# Altium schematic sheet BLDC-DRIVER.SchDoc
size 420 x 297 mm; DocumentNumber: АБВГ.000000.000 Э3; SheetNumber: 2; PageSetup: Record=PageOptions|CenterHorizontal=False|CenterVertical=False|PrintScale=0.95|XCorrection=0.00|YCorrection=0.00|PrintKind=1|BorderSize=5000000|LeftOffset=0|BottomOffset=0|Orientation=1|PaperLength=1000|PaperWidth=1000|Scale=100|PaperSource=15|PrintQuality=600|MediaType=1|DitherType=10|PaperKind=A4|PrintScaleMode=1; Letter1Column: {}; Letter2Column: {}; Letter3Column: {}; ProcessInspection: ProcessInspection; EngineerName: EngineerName; NormInspection: NormInspection; DocumentType: DocumentType; Mass: Mass; Scale: Scale; Developer1size1str: Developer1size1str; Developer2size1str: Developer2size1str; Developer2size2str: Developer2size2str; Title1size1str: Title1size1str; Title2size1str: Title2size1str; Title2size2str: Title2size2str; Title3size3str: Title3size3str; Title3size2str: Title3size2str; Title3size1str: Title3size1str; FunctionalGroup: #_
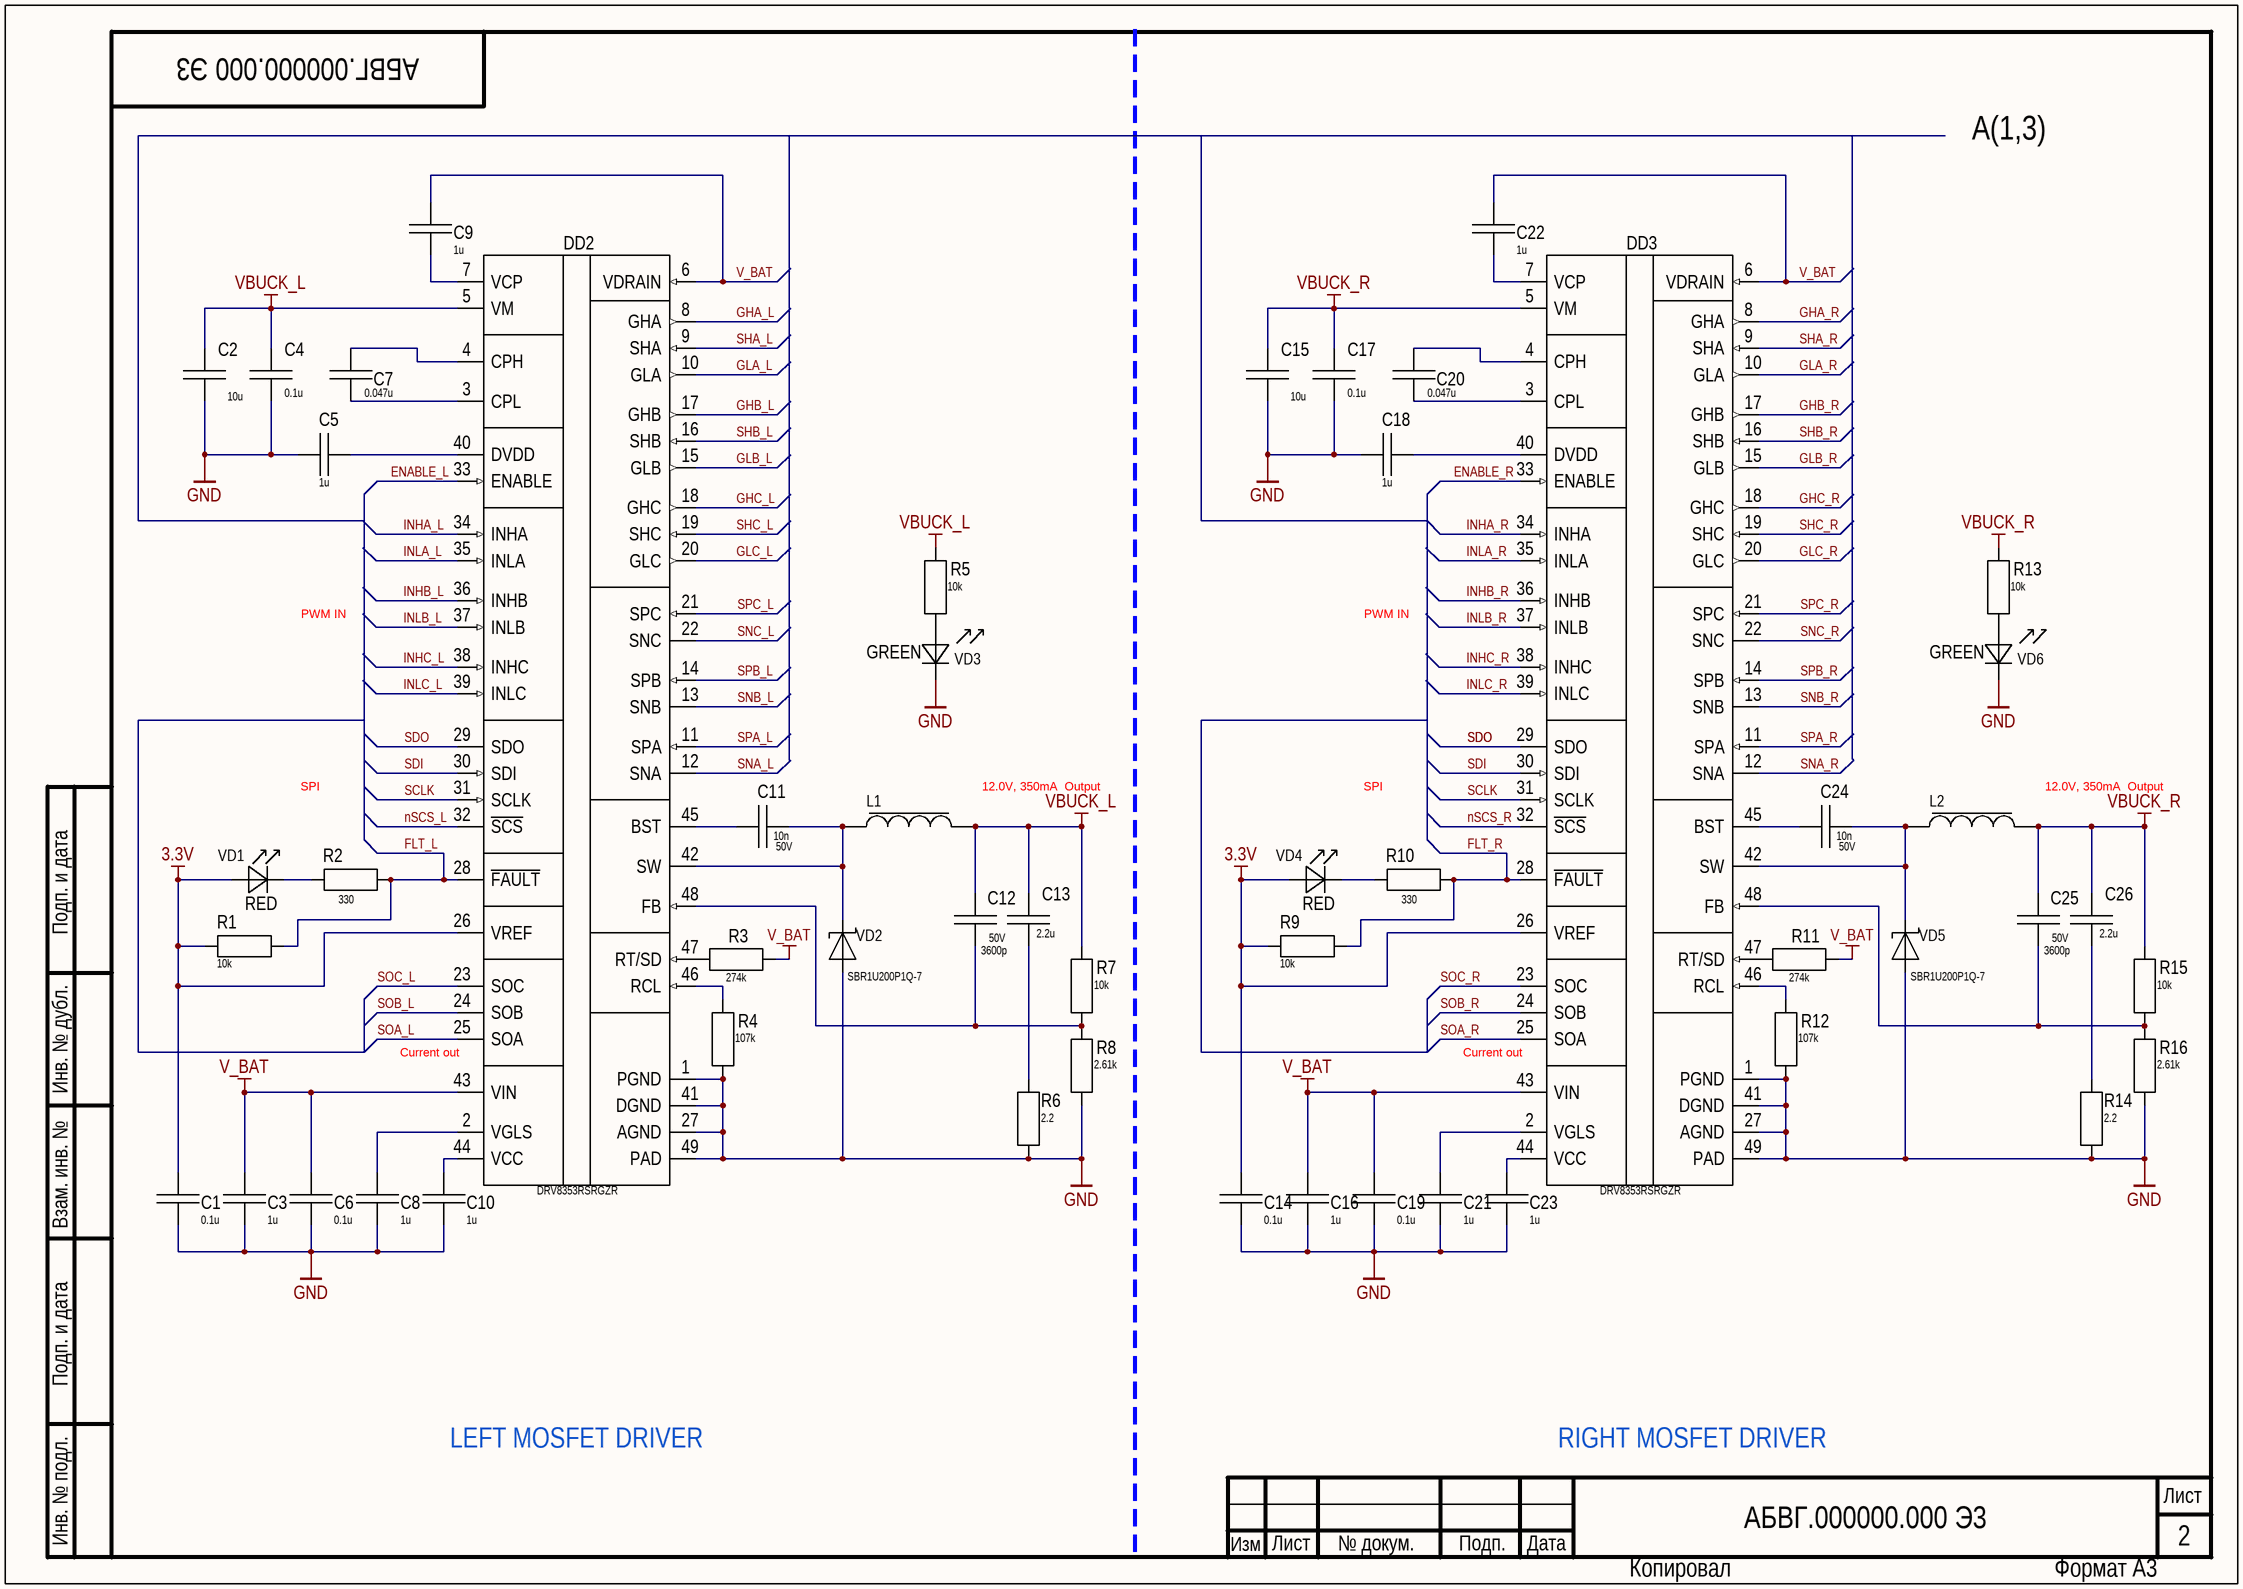
[diagram p0: BLDC-DRIVER.SchDoc]

## Parts
C1  0.1u  [CAP: 0402]
C2  10u  [CAP: 2220]
C3  1u  [CAP: 1206]
C4  0.1u  [CAP: 0805]
C5  1u  [CAP: 0603]
C6  0.1u  [CAP: 0805]
C7  0.047u  [CAP: 0805]
C8  1u  [CAP: 0603]
C9  1u  [CAP: 1206]
C10  1u  [CAP: 0603]
C11  Voltage: 50V  [CAP: 0402]  (hidden comment: 10n)
C12  Voltage: 50V  [CAP: 0402]  (hidden comment: 3600p)
C13  2.2u  [CAP: 0603]
C14  0.1u  [CAP: 0402]
C15  10u  [CAP: 2220]
C16  1u  [CAP: 1206]
C17  0.1u  [CAP: 0805]
C18  1u  [CAP: 0603]
C19  0.1u  [CAP: 0805]
C20  0.047u  [CAP: 0805]
C21  1u  [CAP: 0603]
C22  1u  [CAP: 1206]
C23  1u  [CAP: 0603]
C24  Voltage: 50V  [CAP: 0402]  (hidden comment: 10n)
C25  Voltage: 50V  [CAP: 0402]  (hidden comment: 3600p)
C26  2.2u  [CAP: 0603]
DD2  DRV8353RSRGZR  [48-VQFN]
DD3  DRV8353RSRGZR  [48-VQFN]
L1  (no value)  [IND: 2525]
L2  (no value)  [IND: 2525]
R1  10k  [RES: 0402]
R2  330  [RES: 0402]
R3  274k  [RES: 0402]
R4  107k  [RES: 0402]
R5  10k  [RES: 0402]
R6  2.2  [RES: 0603]
R7  10k  [RES: 0402]
R8  2.61k  [RES: 0402]
R9  10k  [RES: 0402]
R10  330  [RES: 0402]
R11  274k  [RES: 0402]
R12  107k  [RES: 0402]
R13  10k  [RES: 0402]
R14  2.2  [RES: 0603]
R15  10k  [RES: 0402]
R16  2.61k  [RES: 0402]
VD1  value RED  [LED: 0402R]  (hidden comment: Led 0402 RED)
VD2  PartNumber: SBR1U200P1Q-7  [DIODE: PowerDI 123]
VD3  value GREEN  [LED: 0402G]  (hidden comment: Led 0402 GREEN)
VD4  value RED  [LED: 0402R]  (hidden comment: Led 0402 RED)
VD5  PartNumber: SBR1U200P1Q-7  [DIODE: PowerDI 123]
VD6  value GREEN  [LED: 0402G]  (hidden comment: Led 0402 GREEN)

## Nets
3.3V: C1.1 C14.1 DD2.26(VREF) DD3.26(VREF) R1.2 R9.2 VD1.1 VD4.1
GND: C1.2 C2.1 C3.1 C4.1 C5.2 C6.1 C8.1 C10.1 C14.2 C15.1 C16.1 C17.1 C18.2 C19.1 C21.1 C23.1 DD2.1(PGND) DD2.27(AGND) DD2.41(DGND) DD2.49(PAD) DD3.1(PGND) DD3.27(AGND) DD3.41(DGND) DD3.49(PAD) R4.1 R6.1 R8.1 R12.1 R14.1 R16.1 VD2.1 VD3.2 VD5.1 VD6.2
V_BAT: C3.2 C6.2 C9.2 C16.2 C19.2 C22.2 DD2.6(VDRAIN) DD2.43(VIN) DD3.6(VDRAIN) DD3.43(VIN) R3.1 R11.1
VBUCK_L: C2.2 C4.2 C12.2 C13.2 DD2.5(VM) L1.1 R5.2 R7.2
VBUCK_R: C15.2 C17.2 C25.2 C26.2 DD3.5(VM) L2.1 R13.2 R15.2
ENABLE_L: DD2.33(ENABLE)
ENABLE_R: DD3.33(ENABLE)
FLT_L: DD2.28(~{FAULT}) R1.1 R2.1
FLT_R: DD3.28(~{FAULT}) R9.1 R10.1
GHA_L: DD2.8(GHA)
GHA_R: DD3.8(GHA)
GHB_L: DD2.17(GHB)
GHB_R: DD3.17(GHB)
GHC_L: DD2.18(GHC)
GHC_R: DD3.18(GHC)
GLA_L: DD2.10(GLA)
GLA_R: DD3.10(GLA)
GLB_L: DD2.15(GLB)
GLB_R: DD3.15(GLB)
GLC_L: DD2.20(GLC)
GLC_R: DD3.20(GLC)
INHA_L: DD2.34(INHA)
INHA_R: DD3.34(INHA)
INHB_L: DD2.36(INHB)
INHB_R: DD3.36(INHB)
INHC_L: DD2.38(INHC)
INHC_R: DD3.38(INHC)
INLA_L: DD2.35(INLA)
INLA_R: DD3.35(INLA)
INLB_L: DD2.37(INLB)
INLB_R: DD3.37(INLB)
INLC_L: DD2.39(INLC)
INLC_R: DD3.39(INLC)
nSCS_L: DD2.32(~{SCS})
nSCS_R: DD3.32(~{SCS})
SCLK: DD2.31(SCLK) DD3.31(SCLK)
SDI: DD2.30(SDI) DD3.30(SDI)
SDO: DD2.29(SDO) DD3.29(SDO)
SHA_L: DD2.9(SHA)
SHA_R: DD3.9(SHA)
SHB_L: DD2.16(SHB)
SHB_R: DD3.16(SHB)
SHC_L: DD2.19(SHC)
SHC_R: DD3.19(SHC)
SNA_L: DD2.12(SNA)
SNA_R: DD3.12(SNA)
SNB_L: DD2.13(SNB)
SNB_R: DD3.13(SNB)
SNC_L: DD2.22(SNC)
SNC_R: DD3.22(SNC)
SOA_L: DD2.25(SOA)
SOA_R: DD3.25(SOA)
SOB_L: DD2.24(SOB)
SOB_R: DD3.24(SOB)
SOC_L: DD2.23(SOC)
SOC_R: DD3.23(SOC)
SPA_L: DD2.11(SPA)
SPA_R: DD3.11(SPA)
SPB_L: DD2.14(SPB)
SPB_R: DD3.14(SPB)
SPC_L: DD2.21(SPC)
SPC_R: DD3.21(SPC)
NetC5_1: C5.1 DD2.40(DVDD)
NetC7_1: C7.1 DD2.3(CPL)
NetC7_2: C7.2 DD2.4(CPH)
NetC8_2: C8.2 DD2.2(VGLS)
NetC9_1: C9.1 DD2.7(VCP)
NetC10_2: C10.2 DD2.44(VCC)
NetC11_1: C11.1 DD2.45(BST)
NetC11_2: C11.2 DD2.42(SW) L1.2 VD2.2
NetC12_1: C12.1 DD2.48(FB) R7.1 R8.2
NetC13_1: C13.1 R6.2
NetC18_1: C18.1 DD3.40(DVDD)
NetC20_1: C20.1 DD3.3(CPL)
NetC20_2: C20.2 DD3.4(CPH)
NetC21_2: C21.2 DD3.2(VGLS)
NetC22_1: C22.1 DD3.7(VCP)
NetC23_2: C23.2 DD3.44(VCC)
NetC24_1: C24.1 DD3.45(BST)
NetC24_2: C24.2 DD3.42(SW) L2.2 VD5.2
NetC25_1: C25.1 DD3.48(FB) R15.1 R16.2
NetC26_1: C26.1 R14.2
NetDD2_46: DD2.46(RCL) R4.2
NetDD2_47: DD2.47(RT/SD) R3.2
NetDD3_46: DD3.46(RCL) R12.2
NetDD3_47: DD3.47(RT/SD) R11.2
NetR2_2: R2.2 VD1.2
NetR5_1: R5.1 VD3.1
NetR10_2: R10.2 VD4.2
NetR13_1: R13.1 VD6.1

## Notes on the sheet
- А(1,3)
- PWM IN
- SPI
- (near L1) 12.0V, 350mA  Output
- (near L2) 12.0V, 350mA  Output
- (near DD2) Current out
- (near DD3) Current out
- LEFT MOSFET DRIVER
- RIGHT MOSFET DRIVER
- Подп. и дата
- Инв. № дубл.
- Взам. инв. №
- Инв. № подл.
- Лист
- Изм
- № докум.
- Подп.
- Дата
- Копировал
- Формат А3

## Library data of the parts
C1 C14 = CAP 0402: PartNumber: C0402C104K8PAC; Manufacturer: Kemet; Voltage: 10V; Type: Capacitor; Temperature_Range: -55/+85; Tolerance: 10%; Value: 0.1u; Case: 0402
C2 C15 = CAP 2220: PartNumber: CGA9N3X7S2A106K230KE; Voltage: 100V; Tolerance: 10%; Case: 1812; Value: 10u
C3 C9 C16 C22 = CAP 1206: Voltage: 100V; Tolerance: 10%; PartNumber: *; Case: 1206; Value: 1u
C4 C6 C7 C17 C19 C20 = CAP 0805: Voltage: 100V; Tolerance: 10%; PartNumber: *; Case: 0805
  C4 C6 C17 C19: Value: 0.1u
  C7 C20: Value: 0.047u
C5 C8 C10 C18 C21 C23 = CAP 0603: Voltage: 16V; Tolerance: 10%; PartNumber: *; Case: 0603; ComponentLink1Description: Mouser; ComponentLink1URL: *; Value: 1u
C11 C24 = CAP 0402: Tolerance: 10%; PartNumber: *; Case: 0402; Value: 10n
C12 C25 = CAP 0402: Tolerance: 5%; PartNumber: *; Case: 0402; Value: 3600p
C13 C26 = CAP 0603: Voltage: 35V; Tolerance: 10%; PartNumber: *; Case: 0603; ComponentLink1Description: Mouser; ComponentLink1URL: *; Value: 2.2u
L1 L2 = Inductor_2525: TypeInductor: Fixed inductor; Temperature: -40...+150°C
R1-R5 R7-R13 R15 R16 = RES 0402: Tolerance: 1%; PartNumber: *
  R1 R5 R7 R9 R13 R15: Value: 10k
  R2 R10: Value: 330
  R3 R11: Value: 274k
  R4 R12: Value: 107k
  R8 R16: Value: 2.61k
R6 R14 = RES 0603: Tolerance: 1%; PartNumber: *; Value: 2.2
VD2 VD5 = Schottky_single: Manufacturer: Diodes Incorporated; ValueManufacturerPartNumber: Schottky diode, 200V, 1A, 850mV, 15pF, PowerDI-123-2, -55...+150°C; TypeDiode: Schottky diode; Voltage: 200V; Current: 1A; VoltageDrop: 850mV; RecoveryTime: 15pF; Package: PowerDI-123-2; HelpURL: https://www.digikey.com/product-detail/en/diodes-incorporated/MBR0580S1-7/MBR0580S1-7DICT-ND/5080371; Temperature: -55...+150°C